# EAGLE design handle_board (EAGLE 7.2.0)
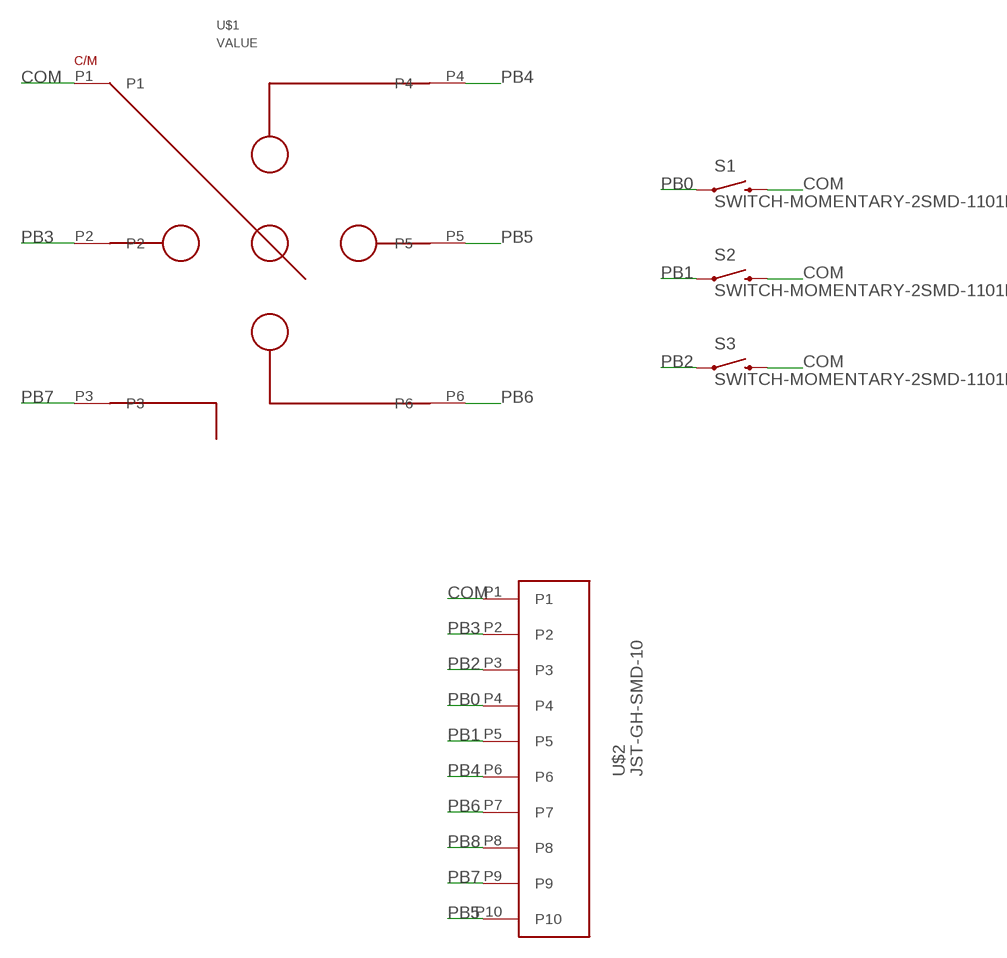
[diagram p0: schematic, sheet 1]

## Parts
S1  SWITCH-MOMENTARY-2SMD-1101NE  [TACTILE-SWITCH-1101NE]
S2  SWITCH-MOMENTARY-2SMD-1101NE  [TACTILE-SWITCH-1101NE]
S3  SWITCH-MOMENTARY-2SMD-1101NE  [TACTILE-SWITCH-1101NE]
U$1  JS_5208_HAT  [JS_5208_HAT]
U$2  JST-GH-SMD-10  [JST-GH-SMD-10]

## Nets
COM: S1.2 S2.2 S3.2 U$1.P1 U$2.P1
PB0: S1.1 U$2.P4
PB1: S2.1 U$2.P5
PB2: S3.1 U$2.P3
PB3: U$1.P2 U$2.P2
PB4: U$1.P4 U$2.P6
PB5: U$1.P5 U$2.P10
PB6: U$1.P6 U$2.P7
PB7: U$1.P3 U$2.P9
PB8: U$2.P8

## Library data of the parts
S1-S3 = SparkFun-Electromechanical:SWITCH-MOMENTARY-2: Various NO switches- pushbuttons, reed, etc; PROD_ID: SWCH-00815
U$1 = SparkFun-Electromechanical:JS_5208_HAT
U$2 = SparkFun-Connectors:JST-GH-SMD-10

## Board
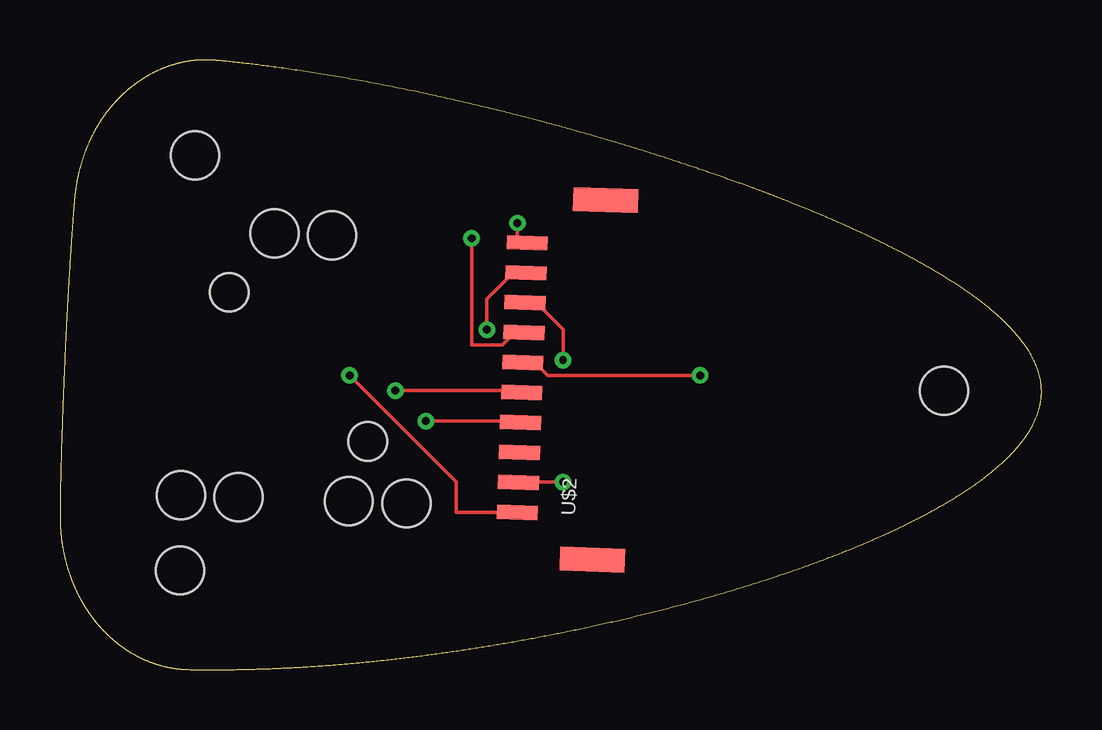
[diagram p1: board, top side]
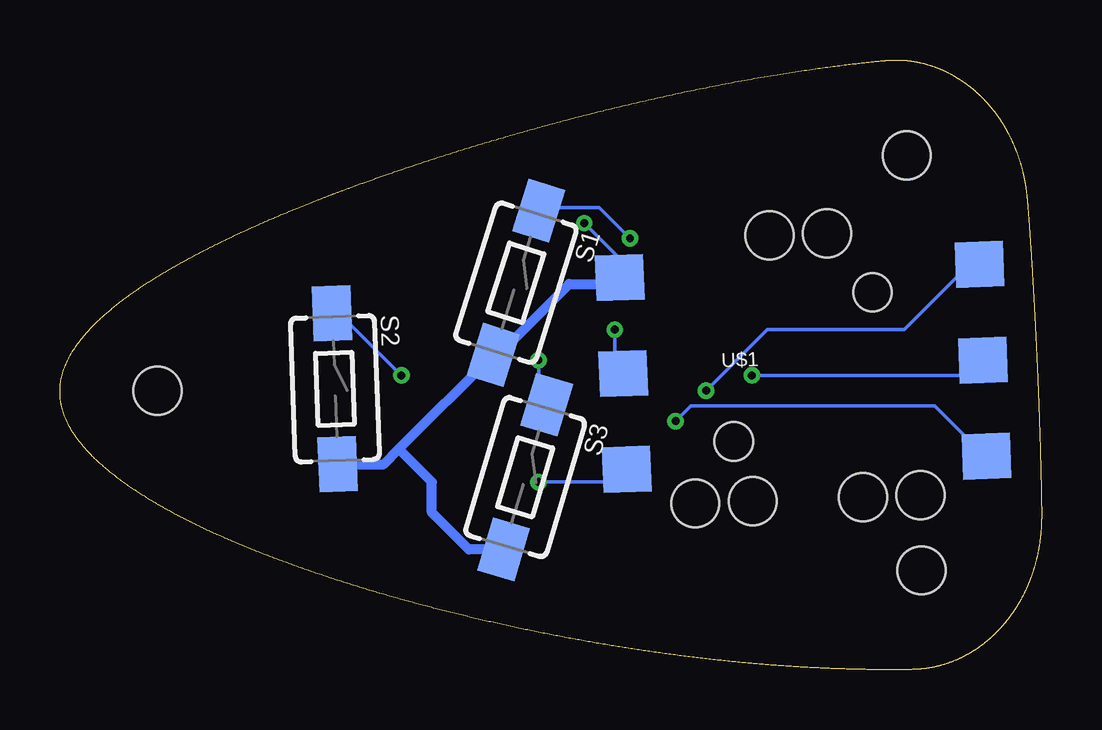
[diagram p2: board, bottom side, seen from below]

Size 40.9 x 25.43 mm. Coordinates in mm from the lower left corner, seen from the top.
Outline: 1912 segments
Copper layers (1*16): Top 0.0356mm / dielectric 1.5011mm / Bottom 0.0356mm
Design rules "LaenPCBOrder": minimum track width 6mil, minimum drill 13mil, track to track 6mil, track to pad 6mil, pad to pad 6mil, via to via 6mil, smd to smd 6mil, copper to edge 15mil, drill to drill 6mil, minimum pad ring 7mil, minimum via ring 7mil, stop-mask expansion 3mil, vias tented up to drill 0mil, thermal gap 10mil
Holes 2 mm at 5.01,4.15 5.62,21.44 36.83,11.64

### Footprints (pad centres in the part's own frame; a part is rotated, then mirrored left to right if it is on the bottom)
TACTILE-SWITCH-1101NE = smd 2.3 x 1.6: 1 -3.15,0; 2 3.15,0
JS_5208_HAT = smd 2 x 1.9: P1 -7.5,4; P2 -7.5,0; P3 -7.5,-4; P4 7.5,4; P5 7.5,0; P6 7.5,-4 | hole 1.6: 3,3; -3,-3 | hole 2: -4.7,-5.525; -2.3,-5.525; 2.3,-5.525; 4.7,-5.525; 1.2,5.525; -1.2,5.525
JST-GH-SMD-10 = smd 1 x 2.7: NC1 -1.85,-3.2; NC2 13.15,-3.2 | smd 0.6 x 1.7: P1 11.25,0; P2 10,0; P3 8.75,0; P4 7.5,0; P5 6.25,0; P6 5,0; P7 3.75,0; P8 2.5,0; P9 1.25,0; P10 0,0

### Placement (x,y rotation side)
S1  21.9,16.14 252.5 bottom
S2  29.44,11.72 272.1 bottom
S3  21.52,8.03 253.4 bottom
U$1  9.94,12.63 2.1 bottom
U$2  19.05,6.56 87.9 top

### Tracks (layer width: path | path; a pad name or v marks a point on that pad's centre or on a via)
COM  (via drill 0.33)
  Top 0.152: v19.05,18.63 19.05,17.99 U$2.P1
  Bottom 0.152: v19.05,18.63 17.15,16.72 U$1.P1 17.78,16.09 | 22.23,13.55 S1.2
  Bottom 0.406: S2.2 27.41,8.57 26.78,9.2 | 26.78,9.2 S1.2 | S3.2 23.86,5.01 25.4,6.56 25.4,7.83 26.78,9.2 | 22.23,13.55 19.69,16.09 17.78,16.09
PB0  (via drill 0.33)
  Top 0.152: v17.15,17.99 17.15,13.55 18.42,13.55 19.05,14.18 U$2.P4
  Bottom 0.152: v17.15,17.99 18.42,19.26 20.32,19.26 S1.1
PB1  (via drill 0.33)
  Top 0.152: v26.67,12.28 20.32,12.28 19.69,12.91 U$2.P5
  Bottom 0.152: v26.67,12.28 29.21,14.82 S2.1
PB2  (via drill 0.33)
  Top 0.152: v20.96,12.91 20.96,14.18 19.69,15.45 U$2.P3
  Bottom 0.152: v20.96,12.91 20.96,11.64 S3.1
PB3  (via drill 0.33)
  Top 0.152: v17.78,14.18 17.78,15.45 19.05,16.72 U$2.P2
  Bottom 0.152: v17.78,14.18 17.78,12.91 U$1.P2
PB4  (via drill 0.33)
  Top 0.152: v13.97,11.64 19.05,11.64 U$2.P6
  Bottom 0.152: v13.97,11.64 11.43,14.18 5.72,14.18 3.18,16.72 U$1.P4
PB5  (via drill 0.33)
  Top 0.152: U$2.P10 16.51,6.56 16.51,7.83 v12.07,12.28
  Bottom 0.152: v12.07,12.28 2.54,12.28 U$1.P5
PB6  (via drill 0.33)
  Top 0.152: v15.24,10.37 19.05,10.37 U$2.P7
  Bottom 0.152: v15.24,10.37 14.61,11.01 4.45,11.01 2.54,9.1 U$1.P6
PB7  (via drill 0.33)
  Top 0.152: v20.96,7.83 19.69,7.83 U$2.P9
  Bottom 0.152: v20.96,7.83 17.78,7.83 U$1.P3